# EAGLE design ACS712 (EAGLE 5.06)
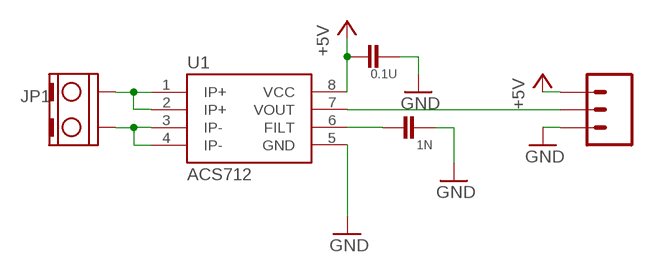
[diagram p0: schematic, sheet 1]

## Parts
C3  1N  CAP-0603  [0603-CAP]
C4  0.1U  CAP-0603  [0603-CAP]
J1  M03  [M03]
JP1  TERM-2WAY  [TERM-BLOCK-2WAY]
U1  ACS712  [SO08]

## Nets
+5V: C4.3 J1.1 U1.8(VCC)
C1: JP1.2(KL) U1.1(IP+) U1.2(IP+)
C2: JP1.1(KL1) U1.3(IP-) U1.4(IP-)
FILTER: C3.3 U1.6(FILT)
GND: C3.4 C4.4 J1.3 U1.5(GND)
VOUT: J1.2 U1.7(VOUT)

## Library data of the parts
C3 C4 = Travis:CAP-0603
J1 = Travis:M03
JP1 = Travis:TERM-2WAY
U1 = Travis:ACS712

## Board
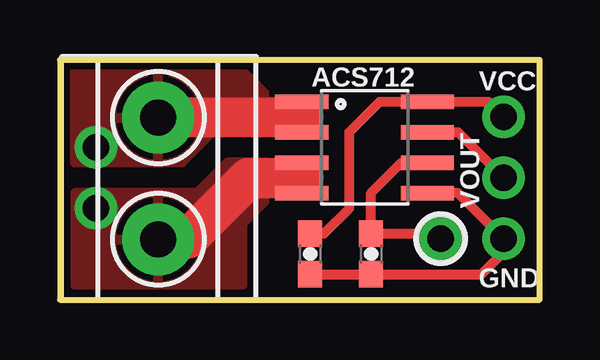
[diagram p1: board, top side]
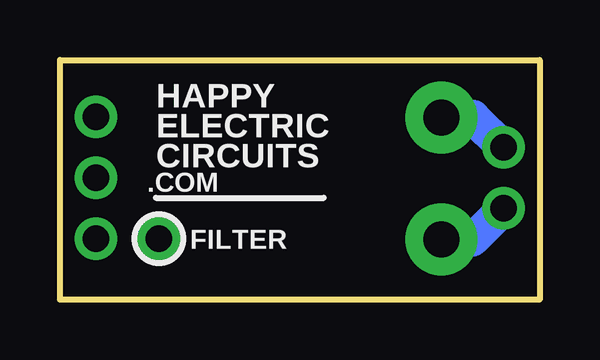
[diagram p2: board, bottom side, seen from below]

Size 20 x 10 mm. Coordinates in mm from the lower left corner, seen from the top.
Outline: 0,0 20,0 20,10 0,10 0,0
Copper layers (1*16): Top 0.035mm / dielectric 1.5mm / Bottom 0.035mm
Design rules "SparkFun": minimum track width 8mil, minimum drill 20mil, track to track 8mil, track to pad 8mil, pad to pad 8mil, via to via 8mil, smd to smd 8mil, copper to edge 10mil, drill to drill 8mil, minimum pad ring 12mil, minimum via ring 10mil, stop-mask expansion 4mil, vias tented up to drill 25mil, thermal gap 10mil

### Footprints (pad centres in the part's own frame; a part is rotated, then mirrored left to right if it is on the bottom)
0603-CAP = smd 1.1 x 1: 3 -0.85,0; 4 0.85,0
M03 = drill 1.1 pad 1.778 round: 1 0,0; 2 0,-2.54; 3 0,-5.08
TERM-BLOCK-2WAY = drill 1.5 pad 3 round: 1 -2.561,0.025; 2 2.519,0.025
SO08 = smd 0.61 x 2.21: 1 -1.905,-2.616; 2 -0.635,-2.616; 3 0.635,-2.616; 4 1.905,-2.616; 5 1.905,2.616; 6 0.635,2.616; 7 -0.635,2.616; 8 -1.905,2.616

### Placement (x,y rotation side)
C3  12.97,1.91 270 top
C4  10.43,1.91 270 top
J1  18.5,7.62 0 top
JP1  4.13,5.08 90 top
U1  12.7,6.35 270 top

### Tracks (layer width: path | path; a pad name or v marks a point on that pad's centre or on a via)
+5V
  Top 0.406: C4.3 11.01,2.75 12.06,3.81 12.06,6.99 13.34,8.26 U1.8 17.86,8.26 J1.1
C1  (via drill 1.1 pad 1.78)
  Top 1.676: 3.81,7.62 10.16,7.62
  Bottom 1.422: v1.5,6.35 2.77,7.62 4.12,7.62
  pour Top: 10.16,6.99 6.35,6.99 5.08,5.71 0.64,5.71 0.64,9.53 7.62,9.53 8.89,8.26 10.16,8.26
C2  (via drill 1.1 pad 1.78)
  Top 1.676: 10.16,5.08 7.87,5.08 5.33,2.54 3.81,2.54
  Bottom 1.422: v1.5,3.81 2.81,2.5 4,2.5
  pour Top: 10.16,5.71 6.99,5.71 5.71,4.45 0.64,4.45 0.64,0.64 7.62,0.64 7.62,3.17 8.89,4.45 10.16,4.45
FILTER  (via drill 1.1 pad 1.78)
  Top 0.406: U1.6 14.24,5.71 12.97,4.45 C3.3 15.66,2.75 v15.88,2.54
GND
  Top 0.406: C4.4 C3.4 17.57,1.05 18.5,1.99 J1.3 16.59,4.45 U1.5
VOUT
  Top 0.406: U1.7 16.59,6.99 J1.2

### Text on the board
bPlace: .COM
tNames: VCC | VOUT | GND
bNames: HAPPY | ELECTRIC | CIRCUITS | FILTER